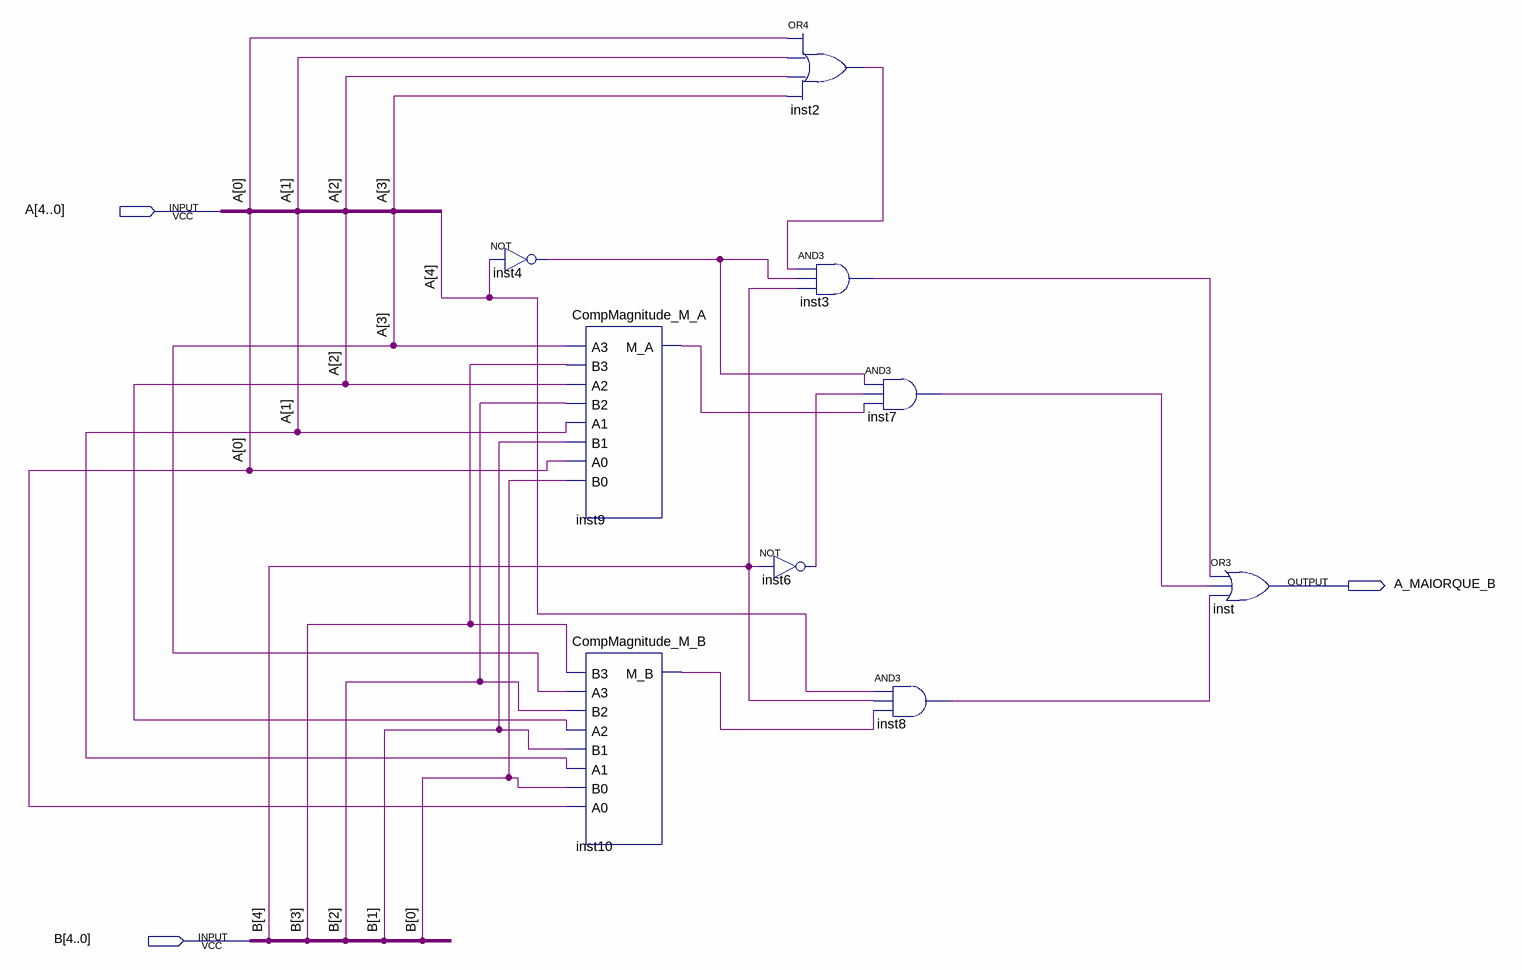
[diagram p0: schematic sheet]
// Quartus schematic M_A.bdf as structural Verilog: 9 symbols, 3 pins
module M_A (
  input  [4:0] A,
  input  [4:0] B,
  output A_MAIORQUE_B
);

  wire inst2_out, inst3_out, inst4_out, inst6_out, inst7_out, inst8_out, inst9_m_a, inst10_m_b;

  not inst4 (inst4_out, A[4]);
  CompMagnitude_M_A inst9 (
    .A3(A[3]), .B3(B[3]), .A2(A[2]), .B2(B[2]), .A1(A[1]), .B1(B[1]), .A0(A[0]), .B0(B[0]), .M_A(inst9_m_a));
  CompMagnitude_M_B inst10 (
    .B3(B[3]), .A3(A[3]), .B2(B[2]), .A2(A[2]), .B1(B[1]), .A1(A[1]), .B0(B[0]), .A0(A[0]), .M_B(inst10_m_b));
  not inst6 (inst6_out, B[4]);
  or inst2 (inst2_out, A[0], A[1], A[2], A[3]);
  and inst3 (inst3_out, inst2_out, inst4_out, B[4]);
  and inst7 (inst7_out, inst4_out, inst6_out, inst9_m_a);
  and inst8 (inst8_out, A[4], B[4], inst10_m_b);
  or inst (A_MAIORQUE_B, inst3_out, inst7_out, inst8_out);
endmodule
